# Altium schematic sheet root.SchDoc
size A4; SheetNumber: 1; SheetTotal: 6
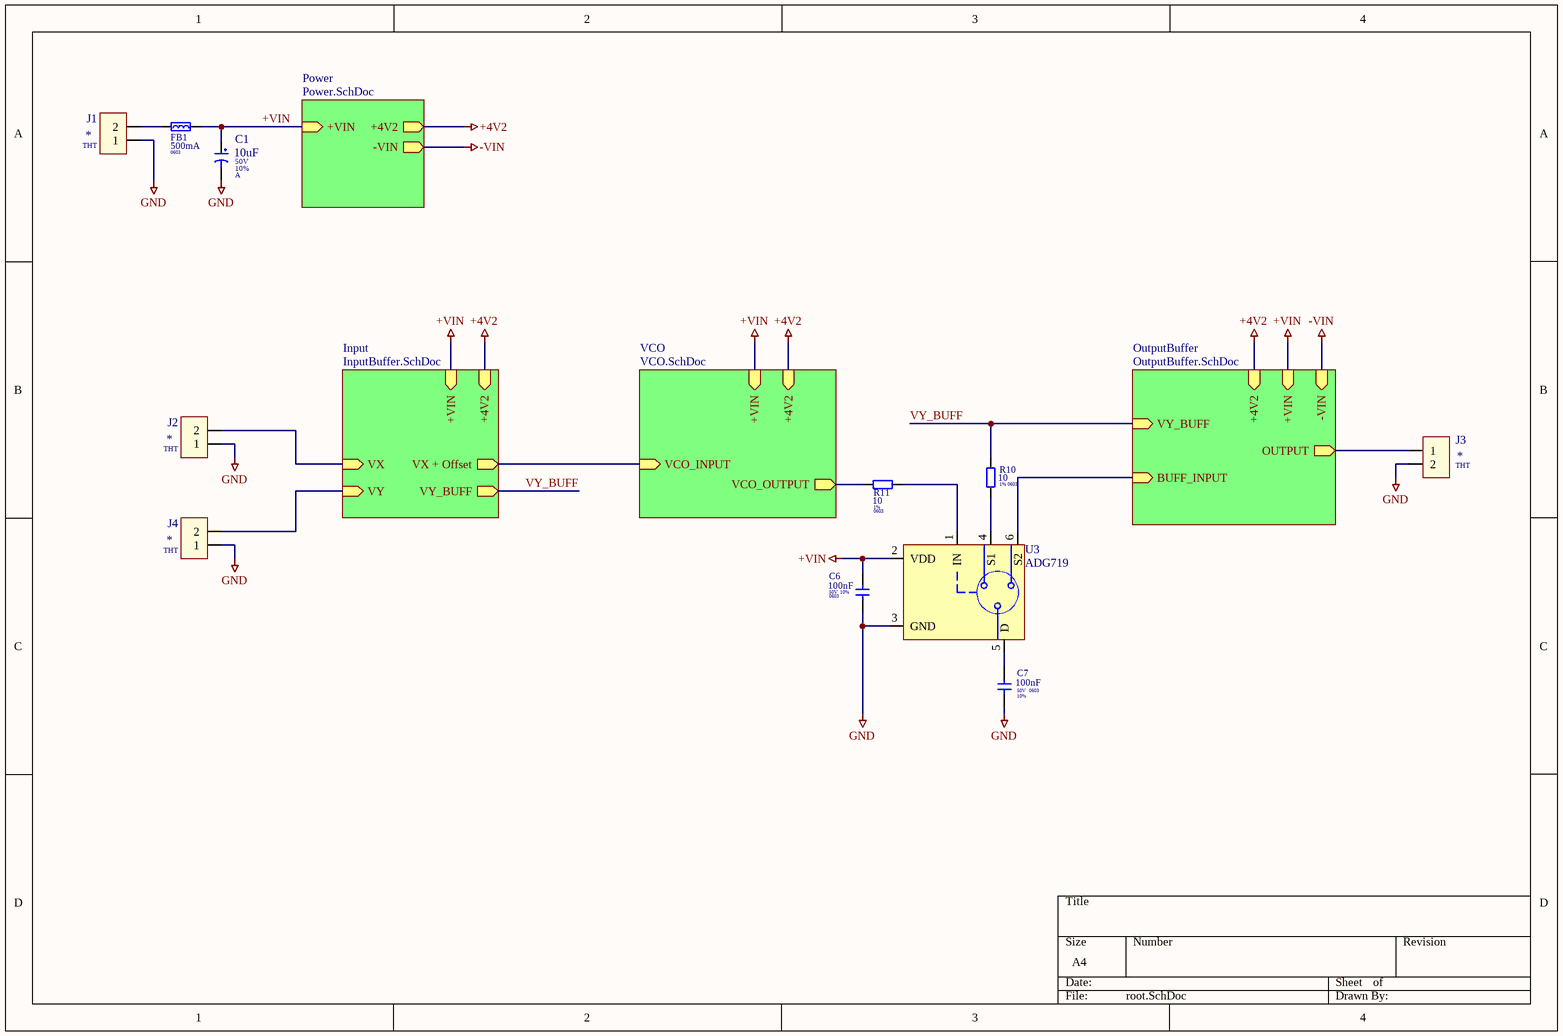
[diagram p0: root.SchDoc]

## Parts
C1  value 10uF  Voltage: 50V  Package: A  Tolerant: 10%  [CAPMP3217X16L]  (hidden comment: 10uF/50V)
C6  value 100nF  Voltage: 50V  Tolerant: 10%  Package: 0603  [CAPC1608X06M]  (hidden comment: 100nF/50V)
C7  value 100nF  Voltage: 50V  Tolerant: 10%  Package: 0603  [CAPC1608X06M]  (hidden comment: 100nF/50V)
FB1  Package: 0603  [INDC2012X07N]  (hidden comment: 500mA)
J1  Package: THT  [ARK2]  (hidden comment: *)
J2  Package: THT  [ARK2]  (hidden comment: *)
J3  Package: THT  [ARK2]  (hidden comment: *)
J4  Package: THT  [ARK2]  (hidden comment: *)
R10  value 10  Package: 0603  Tolerance: 1%  [RESC1608X06L]  (hidden comment: 10 1%)
R11  value 10  Package: 0603  Tolerance: 1%  [RESC1608X06L]  (hidden comment: 10 1%)
U3  ADG719  [SOT363/SC-88]

## Sub-sheets
Input = InputBuffer.SchDoc: VX (in), VX + Offset (out), +4V2 (in), +VIN (in), VY (in), VY_BUFF (out)
OutputBuffer = OutputBuffer.SchDoc: BUFF_INPUT (in), VY_BUFF (in), OUTPUT (out), +4V2 (in), +VIN (in), -VIN (in)
Power = Power.SchDoc: +VIN (in), +4V2 (out), -VIN (out)
VCO = VCO.SchDoc: +4V2 (in), +VIN (in), VCO_INPUT (in), VCO_OUTPUT (out)

## Nets
+4V2: sheet VCO/+4V2, sheet Power/+4V2, sheet Input/+4V2, sheet OutputBuffer/+4V2
+VIN: C1.1 C6.2 FB1.2 U3.2(VDD) ; sheet VCO/+VIN, sheet Power/+VIN, sheet Input/+VIN, sheet OutputBuffer/+VIN
-VIN: sheet Power/-VIN, sheet OutputBuffer/-VIN
GND: C1.2 C6.1 C7.1 J1.1 J2.1 J3.2 J4.1 U3.3(GND)
VY_BUFF: R10.2 ; sheet Input/VY_BUFF, sheet OutputBuffer/VY_BUFF
NetC7_2: C7.2 U3.5(D)
NetFB1_1: FB1.1 J1.2
NetJ2_2: J2.2 ; sheet Input/VX
NetJ3_1: J3.1 ; sheet OutputBuffer/OUTPUT
NetJ4_2: J4.2 ; sheet Input/VY
NetR10_1: R10.1 U3.4(S1)
NetR11_1: R11.1 ; sheet VCO/VCO_OUTPUT
NetR11_2: R11.2 U3.1(IN)
NetU3_6: U3.6(S2) ; sheet OutputBuffer/BUFF_INPUT
(unnamed): sheet VCO/VCO_INPUT, sheet Input/VX + Offset

## Library data of the parts
C1 = C_TANTAL: WORKPLAN_Code: EP00; manufacture: *; helpurl: *
C6 C7 = C
FB1 = FB: manufacture: *; helpurl: *; value: 500mA
J1-J4 = CON_2PIN: WORKPLAN_Code: EP00; manufacture: *; helpurl: *; value: *
R10 R11 = R
U3 = ADG719: Analogue Switch ICs LOW VOLTAGE SINGEL SPDT; DataSheet: https://www.analog.com/media/en/technical-documentation/data-sheets/ADG719.pdf; Mouser: https://www.mouser.pl/ProductDetail/Analog-Devices/ADG719BRTZ-REEL7?qs=BpaRKvA4VqFaSWmiDs8izg%3D%3D&utm_id=20109199562&gad_source=1&gclid=Cj0KCQiA57G5BhDUARIsACgCYnxDS6CW5NFKHO1UnA1TKx4mLoyVdeZEORDHvH8gi9WRrzOxhw7N7oQaAhUnEALw_wcB; value: ADG719